# Altium project SpeakEasy_Logic.PrjPcb
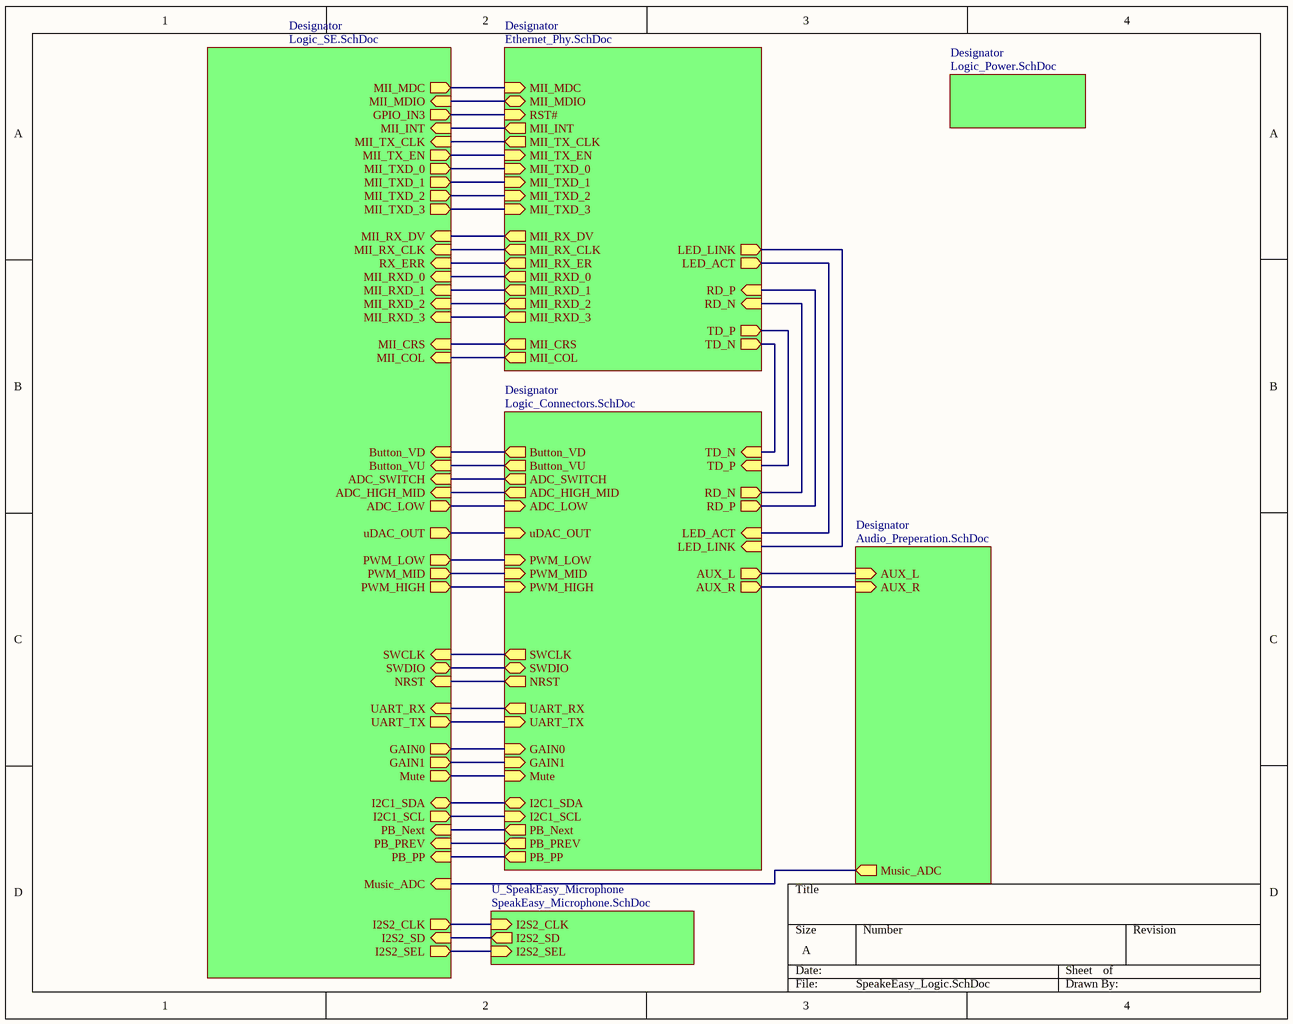
[diagram p0: SpeakeEasy_Logic.SchDoc]
7 sheets, 87 parts. Net scope: hierarchical (ports join the sheet entries above them; power ports are global).
Board file: SpeakEasy_Logic.PcbDoc
Sheets:
  SpeakeEasy_Logic.SchDoc
    Designator = Logic_SE.SchDoc
    Designator = Ethernet_Phy.SchDoc
    Designator = Logic_Connectors.SchDoc
    Designator = Logic_Power.SchDoc
    Designator = Audio_Preperation.SchDoc
    U_SpeakEasy_Microphone = SpeakEasy_Microphone.SchDoc

## Sheet SpeakeEasy_Logic.SchDoc
size A

### Sub-sheets
Designator = Logic_SE.SchDoc: MII_MDC (out), UART_RX (in), MII_TXD_2 (out), MII_CRS (in), I2C1_SCL (out), UART_TX (out), MII_TXD_0 (out), MII_MDIO (in), MII_COL (in), MII_TX_EN (out), MII_RX_DV (in), I2C1_SDA (bidir), MII_TXD_1 (out), MII_RX_CLK (in), MII_TXD_3 (out), MII_TX_CLK (in), GPIO_IN3 (out), PWM_LOW (out), PWM_HIGH (out), PWM_MID (out), Button_VD (in), Button_VU (in), uDAC_OUT (out), MII_RXD_0 (in), MII_RXD_3 (in), MII_RXD_2 (in), MII_RXD_1 (in), Music_ADC (in), SWDIO (bidir), SWCLK (in), NRST (in), GAIN1 (out), Mute (out), GAIN0 (out), ADC_HIGH_MID (in), ADC_SWITCH (in), ADC_LOW (out), PB_Next (in), PB_PP (in), PB_PREV (in), RX_ERR (in), I2S2_CLK (out), I2S2_SD (in), MII_INT (in), I2S2_SEL (out)
Designator = Ethernet_Phy.SchDoc: MII_MDC (in), MII_TXD_3 (in), MII_MDIO (bidir), MII_TXD_0 (in), RST# (in), MII_TX_CLK (out), MII_CRS (out), MII_RX_DV (out), MII_RX_CLK (out), MII_TX_EN (in), MII_TXD_1 (in), MII_TXD_2 (in), MII_RX_ER (out), MII_COL (out), LED_ACT (out), LED_LINK (out), TD_N (out), TD_P (out), RD_P (in), RD_N (in), MII_RXD_3 (out), MII_RXD_1 (out), MII_RXD_0 (out), MII_RXD_2 (out), MII_INT (out)
Designator = Logic_Connectors.SchDoc: Button_VD (out), TD_N (in), TD_P (in), LED_ACT (in), RD_N (out), RD_P (out), AUX_L (out), LED_LINK (in), AUX_R (out), Button_VU (out), PWM_LOW (in), PWM_HIGH (in), uDAC_OUT (in), PWM_MID (in), NRST (out), SWDIO (bidir), UART_TX (in), SWCLK (out), UART_RX (out), GAIN0 (in), GAIN1 (in), Mute (in), ADC_SWITCH (out), ADC_HIGH_MID (out), ADC_LOW (in), I2C1_SCL (in), I2C1_SDA (bidir), PB_PP (out), PB_Next (out), PB_PREV (out)
Designator = Logic_Power.SchDoc: no entries
Designator = Audio_Preperation.SchDoc: Music_ADC (out), AUX_L (in), AUX_R (in)
U_SpeakEasy_Microphone = SpeakEasy_Microphone.SchDoc: I2S2_SD (out), I2S2_CLK (in), I2S2_SEL (in)

### Nets
ADC_HIGH_MID: sheet Designator/ADC_HIGH_MID, sheet Designator/ADC_HIGH_MID
ADC_LOW: sheet Designator/ADC_LOW, sheet Designator/ADC_LOW
AUX_L: sheet Designator/AUX_L, sheet Designator/AUX_L
AUX_R: sheet Designator/AUX_R, sheet Designator/AUX_R
Button_VD: sheet Designator/Button_VD, sheet Designator/Button_VD
Button_VU: sheet Designator/Button_VU, sheet Designator/Button_VU
GAIN0: sheet Designator/GAIN0, sheet Designator/GAIN0
GAIN1: sheet Designator/GAIN1, sheet Designator/GAIN1
GPIO_IN3: sheet Designator/GPIO_IN3, sheet Designator/RST#
I2C1_SCL: sheet Designator/I2C1_SCL, sheet Designator/I2C1_SCL
I2C1_SDA: sheet Designator/I2C1_SDA, sheet Designator/I2C1_SDA
I2S2_CLK: sheet Designator/I2S2_CLK, sheet U_SpeakEasy_Microphone/I2S2_CLK
I2S2_SD: sheet Designator/I2S2_SD, sheet U_SpeakEasy_Microphone/I2S2_SD
I2S2_SEL: sheet Designator/I2S2_SEL, sheet U_SpeakEasy_Microphone/I2S2_SEL
LED_ACT: sheet Designator/LED_ACT, sheet Designator/LED_ACT
LED_LINK: sheet Designator/LED_LINK, sheet Designator/LED_LINK
MII_COL: sheet Designator/MII_COL, sheet Designator/MII_COL
MII_CRS: sheet Designator/MII_CRS, sheet Designator/MII_CRS
MII_INT: sheet Designator/MII_INT, sheet Designator/MII_INT
MII_MDC: sheet Designator/MII_MDC, sheet Designator/MII_MDC
MII_MDIO: sheet Designator/MII_MDIO, sheet Designator/MII_MDIO
MII_RX_CLK: sheet Designator/MII_RX_CLK, sheet Designator/MII_RX_CLK
MII_RX_DV: sheet Designator/MII_RX_DV, sheet Designator/MII_RX_DV
MII_RX_ER: sheet Designator/RX_ERR, sheet Designator/MII_RX_ER
MII_RXD_0: sheet Designator/MII_RXD_0, sheet Designator/MII_RXD_0
MII_RXD_1: sheet Designator/MII_RXD_1, sheet Designator/MII_RXD_1
MII_RXD_2: sheet Designator/MII_RXD_2, sheet Designator/MII_RXD_2
MII_RXD_3: sheet Designator/MII_RXD_3, sheet Designator/MII_RXD_3
MII_TX_CLK: sheet Designator/MII_TX_CLK, sheet Designator/MII_TX_CLK
MII_TX_EN: sheet Designator/MII_TX_EN, sheet Designator/MII_TX_EN
MII_TXD_0: sheet Designator/MII_TXD_0, sheet Designator/MII_TXD_0
MII_TXD_1: sheet Designator/MII_TXD_1, sheet Designator/MII_TXD_1
MII_TXD_2: sheet Designator/MII_TXD_2, sheet Designator/MII_TXD_2
MII_TXD_3: sheet Designator/MII_TXD_3, sheet Designator/MII_TXD_3
Music_ADC: sheet Designator/Music_ADC, sheet Designator/Music_ADC
Mute: sheet Designator/Mute, sheet Designator/Mute
NRST: sheet Designator/NRST, sheet Designator/NRST
PB_Next: sheet Designator/PB_Next, sheet Designator/PB_Next
PB_PP: sheet Designator/PB_PP, sheet Designator/PB_PP
PB_PREV: sheet Designator/PB_PREV, sheet Designator/PB_PREV
PWM_HIGH: sheet Designator/PWM_HIGH, sheet Designator/PWM_HIGH
PWM_LOW: sheet Designator/PWM_LOW, sheet Designator/PWM_LOW
PWM_MID: sheet Designator/PWM_MID, sheet Designator/PWM_MID
RD_N: sheet Designator/RD_N, sheet Designator/RD_N
RD_P: sheet Designator/RD_P, sheet Designator/RD_P
SWCLK: sheet Designator/SWCLK, sheet Designator/SWCLK
SWDIO: sheet Designator/SWDIO, sheet Designator/SWDIO
TD_N: sheet Designator/TD_N, sheet Designator/TD_N
TD_P: sheet Designator/TD_P, sheet Designator/TD_P
UART_RX: sheet Designator/UART_RX, sheet Designator/UART_RX
UART_TX: sheet Designator/UART_TX, sheet Designator/UART_TX
uDAC_OUT: sheet Designator/uDAC_OUT, sheet Designator/uDAC_OUT
NetJ4_1: sheet Designator/ADC_SWITCH, sheet Designator/ADC_SWITCH

## Sheet Logic_SE.SchDoc
size A
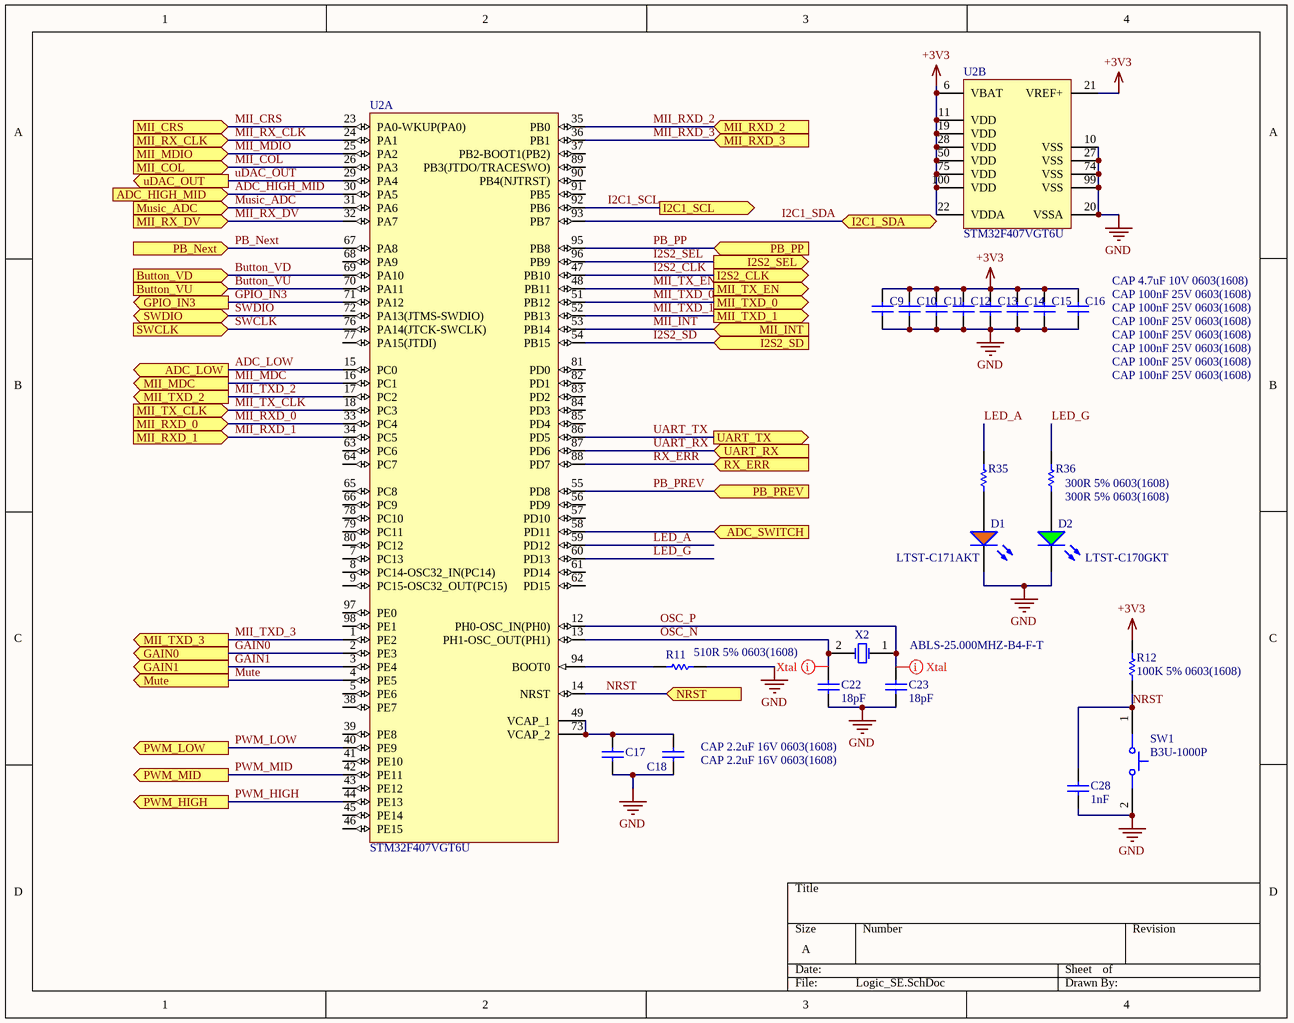
[diagram p1: Logic_SE.SchDoc]

### Parts
(Parts that share a designator on the sheet are numbered #1, #2 ... from top to bottom, then left to right.)
C9  CAP 100nF 25V 0603(1608)  [CAPC0603(1608)100_N]
C10  CAP 100nF 25V 0603(1608)  [CAPC0603(1608)100_N]
C11  CAP 100nF 25V 0603(1608)  [CAPC0603(1608)100_N]
C12  CAP 100nF 25V 0603(1608)  [CAPC0603(1608)100_N]
C13  CAP 100nF 25V 0603(1608)  [CAPC0603(1608)100_N]
C14  CAP 100nF 25V 0603(1608)  [CAPC0603(1608)100_N]
C15#1  CAP 100nF 25V 0603(1608)  [CAPC0603(1608)100_N]
C16  CAP 4.7uF 10V 0603(1608)  [CAPC0603(1608)100_M]
C17  CAP 2.2uF 16V 0603(1608)  [CAPC0603(1608)55_L]
C18  CAP 2.2uF 16V 0603(1608)  [CAPC0603(1608)55_L]
C22  18pF  [CAPC0603(1608)100_L]
C23  18pF  [CAPC0603(1608)100_L]
C28  1nF  [CAPC0603(1608)100_L]
D1  LTST-C171AKT  [LTST-C171AKT_V]
D2  LTST-C170GKT  [LTST-C170GKT_V]
R11  510R 5% 0603(1608)  [RESC0603(1608)_L]
R12  100K 5% 0603(1608)  [RESC0603(1608)_N]
R35  300R 5% 0603(1608)  [RESC0603(1608)_N]
R36  300R 5% 0603(1608)  [RESC0603(1608)_N]
SW1  B3U-1000P  [OMRON-B3U-1000_V]
U2  STM32F407VGT6U  [STM-LQFP100_V]  (parts A,B of 2)
X2  ABLS-25.000MHZ-B4-F-T  [ABRA-ABLS2-2_V]

### Ports
ADC_HIGH_MID (in), ADC_LOW (out), ADC_SWITCH (in), Button_VD (in), Button_VU (in), GAIN0 (out), GAIN1 (out), GPIO_IN3 (out), I2C1_SCL (out), I2C1_SDA (bidir), I2S2_CLK (out), I2S2_SD (in), I2S2_SEL (out), MII_COL (in), MII_CRS (in), MII_INT (in), MII_MDC (out), MII_MDIO (in), MII_RX_CLK (in), MII_RX_DV (in), MII_RXD_0 (in), MII_RXD_1 (in), MII_RXD_2 (in), MII_RXD_3 (in), MII_TX_CLK (in), MII_TX_EN (out), MII_TXD_0 (out), MII_TXD_1 (out), MII_TXD_2 (out), MII_TXD_3 (out), Music_ADC (in), Mute (out), NRST (in), PB_Next (in), PB_PP (in), PB_PREV (in), PWM_HIGH (out), PWM_LOW (out), PWM_MID (out), RX_ERR (in), SWCLK (in), SWDIO (bidir), UART_RX (in), UART_TX (out), uDAC_OUT (out)

### Nets
+3V3: C9.2 C10.2 C11.2 C12.2 C13.2 C14.2 C15#1.2 C16.2 R12.2 U2.6(VBAT) U2.11(VDD) U2.19(VDD) U2.21(VREF+) U2.22(VDDA) U2.28(VDD) U2.50(VDD) U2.75(VDD) U2.100(VDD)
GND: C9.1 C10.1 C11.1 C12.1 C13.1 C14.1 C15#1.1 C16.1 C17.1 C18.1 C22.1 C23.1 C28.1 D1.C D2.C R11.2 SW1.2 U2.10(VSS) U2.20(VSSA) U2.27(VSS) U2.74(VSS) U2.99(VSS)
ADC_HIGH_MID: U2.30(PA5) ; port ADC_HIGH_MID
ADC_LOW: U2.15(PC0) ; port ADC_LOW
Button_VD: U2.69(PA10) ; port Button_VD
Button_VU: U2.70(PA11) ; port Button_VU
GAIN0: U2.2(PE3) ; port GAIN0
GAIN1: U2.3(PE4) ; port GAIN1
GPIO_IN3: U2.71(PA12) ; port GPIO_IN3
I2C1_SCL: U2.92(PB6) ; port I2C1_SCL
I2C1_SDA: U2.93(PB7) ; port I2C1_SDA
I2S2_CLK: U2.47(PB10) ; port I2S2_CLK
I2S2_SD: U2.54(PB15) ; port I2S2_SD
I2S2_SEL: U2.96(PB9) ; port I2S2_SEL
LED_A: R35.2 U2.59(PD12)
LED_G: R36.2 U2.60(PD13)
MII_COL: U2.26(PA3) ; port MII_COL
MII_CRS: U2.23(PA0-WKUP(PA0)) ; port MII_CRS
MII_INT: U2.53(PB14) ; port MII_INT
MII_MDC: U2.16(PC1) ; port MII_MDC
MII_MDIO: U2.25(PA2) ; port MII_MDIO
MII_RX_CLK: U2.24(PA1) ; port MII_RX_CLK
MII_RX_DV: U2.32(PA7) ; port MII_RX_DV
MII_RXD_0: U2.33(PC4) ; port MII_RXD_0
MII_RXD_1: U2.34(PC5) ; port MII_RXD_1
MII_RXD_2: U2.35(PB0) ; port MII_RXD_2
MII_RXD_3: U2.36(PB1) ; port MII_RXD_3
MII_TX_CLK: U2.18(PC3) ; port MII_TX_CLK
MII_TX_EN: U2.48(PB11) ; port MII_TX_EN
MII_TXD_0: U2.51(PB12) ; port MII_TXD_0
MII_TXD_1: U2.52(PB13) ; port MII_TXD_1
MII_TXD_2: U2.17(PC2) ; port MII_TXD_2
MII_TXD_3: U2.1(PE2) ; port MII_TXD_3
Music_ADC: U2.31(PA6) ; port Music_ADC
Mute: U2.4(PE5) ; port Mute
NRST: C28.2 R12.1 SW1.1 U2.14(NRST) ; port NRST
OSC_N: C22.2 U2.13(PH1-OSC_OUT(PH1)) X2.2(X2)
OSC_P: C23.2 U2.12(PH0-OSC_IN(PH0)) X2.1(X1)
PB_Next: U2.67(PA8) ; port PB_Next
PB_PP: U2.95(PB8) ; port PB_PP
PB_PREV: U2.55(PD8) ; port PB_PREV
PWM_HIGH: U2.44(PE13) ; port PWM_HIGH
PWM_LOW: U2.40(PE9) ; port PWM_LOW
PWM_MID: U2.42(PE11) ; port PWM_MID
RX_ERR: U2.88(PD7) ; port RX_ERR  [project net MII_RX_ER]
SWCLK: U2.76(PA14(JTCK-SWCLK)) ; port SWCLK
SWDIO: U2.72(PA13(JTMS-SWDIO)) ; port SWDIO
UART_RX: U2.87(PD6) ; port UART_RX
UART_TX: U2.86(PD5) ; port UART_TX
uDAC_OUT: U2.29(PA4) ; port uDAC_OUT
NetC17_2: C17.2 C18.2 U2.49(VCAP_1) U2.73(VCAP_2)
NetD1_A: D1.A R35.1
NetD2_A: D2.A R36.1
NetJ4_1: U2.58(PD11) ; port ADC_SWITCH
NetR11_1: R11.1 U2.94(BOOT0)

Not connected (* = marked no-connect by the designer): U2 5(PE6) 7(PC13) 8(PC14-OSC32_IN(PC14)) 9(PC15-OSC32_OUT(PC15)) 37(PB2-BOOT1(PB2)) 38(PE7) 39(PE8) 41(PE10) 43(PE12) 45(PE14) 46(PE15) 56(PD9) 57(PD10) 61(PD14) 62(PD15) 63(PC6) 64(PC7) 65(PC8) 66(PC9) 68(PA9) 77(PA15(JTDI)) 78(PC10) 79(PC11) 80(PC12) 81(PD0) 82(PD1) 83(PD2) 84(PD3) 85(PD4) 89(PB3(JTDO/TRACESWO)) 90(PB4(NJTRST)) 91(PB5) 97(PE0) 98(PE1)

### Layout directives
net class Xtal: OSC_N, OSC_P

### Library data of the parts
C9-C14 C15#1 = CMP-1035-02589-1: CAP 100nF 25V ±20% 0603 (1608 Metric) Thickness 1mm SMD; Case-EIA: 0603; Tolerance: Â±20%; Case-Metric: 1608; Value: 100nF; Max Thickness: 1 mm; Technology: SMT; Rated Voltage: 25 V
C16 = CMP-1035-02787-1: CAP 4.7uF 10V ±20% 0603 (1608 Metric) Thickness 1mm SMD; Case-EIA: 0603; Case-Metric: 1608; Tolerance: Â±20%; Value: 4.7uF; Max Thickness: 1 mm; Technology: SMT; Rated Voltage: 10 V
C17 C18 = CMP-1035-02764-1: CAP 2.2uF 16V ±20% 0603 (1608 Metric) Thickness 0.55mm SMD; Tolerance: Â±20%; Case-Metric: 1608; Case-EIA: 0603; Value: 2.2uF; Rated Voltage: 16 V; Max Thickness: 0.55 mm; Technology: SMT
C22 C23 C28 = CMP-1590-00005-1: 0603 (1608 Metric) Chip Capacitor; Case-Metric: 1608; Case-EIA: 0603; PackageReference: CAPC0603(1608)100
D1 = CMP-1674-00004-3: LED AMBER CLR THIN 0805 SMD; Manufacturer: Lite-On; PartNumber: LTST-C171AKT; ComponentLink1URL: http://optoelectronics.liteon.com/upload/download/DS-22-99-0170/S_110_LTST-C171AKT.pdf; PackageReference: C171AKT; ComponentLink1Description: Datasheet
D2 = CMP-1674-00002-2: LED GREEN CLEAR 0805 SMD; ComponentLink1Description: Datasheet; PackageReference: C170GKT; ComponentLink1URL: http://media.digikey.com/pdf/Data%20Sheets/Lite-On%20PDFs/LTST-C170GKT.pdf; PartNumber: LTST-C170GKT
R11 = CMP-1012-00067-1: 510R 0.1W 5% 0603 (1608 Metric)  SMD; Case-EIA: 0603; Value: 510.00 Ohm; Case-Metric: 1608; Technology: SMT; Power: 0.1 W; Tolerance: 5 %
R12 R35 R36 = CMP-1012-00122-1: 100K 0.1W 5% 0603 (1608 Metric)  SMD; Case-EIA: 0603; Value: 100000.00 Ohm; Case-Metric: 1608; Tolerance: 5 %; Power: 0.1 W; Technology: SMT
SW1 = CMP-2100-03586-1: Ultra-Small Tactile Switch, 0.05 A, 12 V, -25 to 70 degC, 2-Pin SMD, RoHS, Tape and Reel; Manufacturer: Omron Electronic Components; Operating Force: 1.5N; Current Rating: 50mA; Voltage Rating (DC): 12V; Electrical Life: 200000Cycles; Actuator Length: 0.4mm; Insulation Resistance: 100MOhm; Switch Travel: 0.15mm; Throw Configuration: SPST; Illumination Type: Illuminated; Width: 3mm; Weight: 0.022g; Datasheet Version: 42005.0; Datasheet URL: http://www.omron.com/ecb/products/pdf/en-b3u.pdf; Height: 1.2mm; Package Quantity: 1; REACH SVHC: Unknown; Contact Current Rating: 50mA; Contact Material: Silver; Max Current Rating: 50mA; Package Reference: B3U-1000; Termination: SMD/SMT; Packaging: TapeandReel; Manufacturer URL: http://www.omron.com/; RoHSCompliant: true; Mount: SurfaceMount; Length: 4mm; Min Operating Temperature: -25degC; Depth: 2.5mm; Lead Free: LeadFree; Case/Package: SMD/SMT; Package Description: 2-Pin Surface Mount Device, Body 3 x 2.5 mm; Max Operating Temperature: 70degC; Orientation: Straight
U2 = CMP-0243-00032-2: ARM Cortex-M4 32-bit MCU+FPU, 210 DMIPS, 1024 kB Flash, 192 kB Internal RAM, 82 I/Os, 100-pin LQFP, -40 to 85 degC, Tray; Manufacturer: STMicroelectronics; D/A Converter: 2x12-bit; Supply Voltage(Vcc) min (V): 1.8; Internal RAM Size (kB): 192; I/Os (High Current): 82; FLASH Size (Prog) (kB): 1024; Supply Voltage(Vcc) max (V): 3.6; Operating Frequency(F) (Processor speed) (MHz): 168; ComponentLink3Description: Package Specification; Mounting Technology: Surface Mount; Core: ARM Cortex-M4; PartNumber: STM32F407VGT6U; PackageDescription: 100-Pin Low Profile Quad Flat Package, 14 x 14 mm Body, 0.5 mm Pitch; PackageReference: LQFP100; ComponentLink1URL: http://www.st.com/web/en/home.html; ComponentLink2Description: Datasheet; Packing: Tray; ComponentLink2URL: http://www.st.com/st-web-ui/static/active/en/resource/technical/document/datasheet/DM00037051.pdf; PackageVersion: Rev. 1, 06/2013; ComponentLink3URL: http://www.st.com/st-web-ui/static/active/en/resource/technical/document/data_brief/DM00071938.pdf; DatasheetVersion: Rev. 4; ComponentLink1Description: Manufacturer URL; PartId: 1
X2 = CMP-0277-00002-1: Low Profile Surface Mount Microprocessor Crystal, 25 MHz +/-30 ppm, 180 Ohm, -40 to 85 degC, 2-Pin 11.4 x 4.7 x 3.3 mm SMD, RoHS, Tape and Reel; Manufacturer: Abracon; PartNumber: ABLS2-4.096MHZ-D4Y-T; Operation Mode: Fundamental or 3rd Overtone; Shunt Capacitance: 7 pF Max.; ESR: 180 Ohm; Load Capacitance: 18 pF; Frequency: 4.096 MHz; Mounting Technology: Surface Mount; PackageDescription: 2-Pin SMD, Body 11.4 x 4.7 mm, Height 3.3 mm; ComponentLink1URL: http://www.abracon.com/; Freq. Stability: +/- 30 ppm; ComponentLink2Description: Datasheet; Operating Temp. Range: -40 to 85 degC; Packing: Tape and Reel; RoHS: TRUE; PackageReference: ABLS2-2; DatasheetVersion: Rev. 03.31.11; Freq. Tolerance: +/- 30 ppm; ComponentLink2URL: http://www.abracon.com/Resonators/ABLS2.pdf; ComponentLink1Description: Manufacturer URL

## Sheet Ethernet_Phy.SchDoc
size A
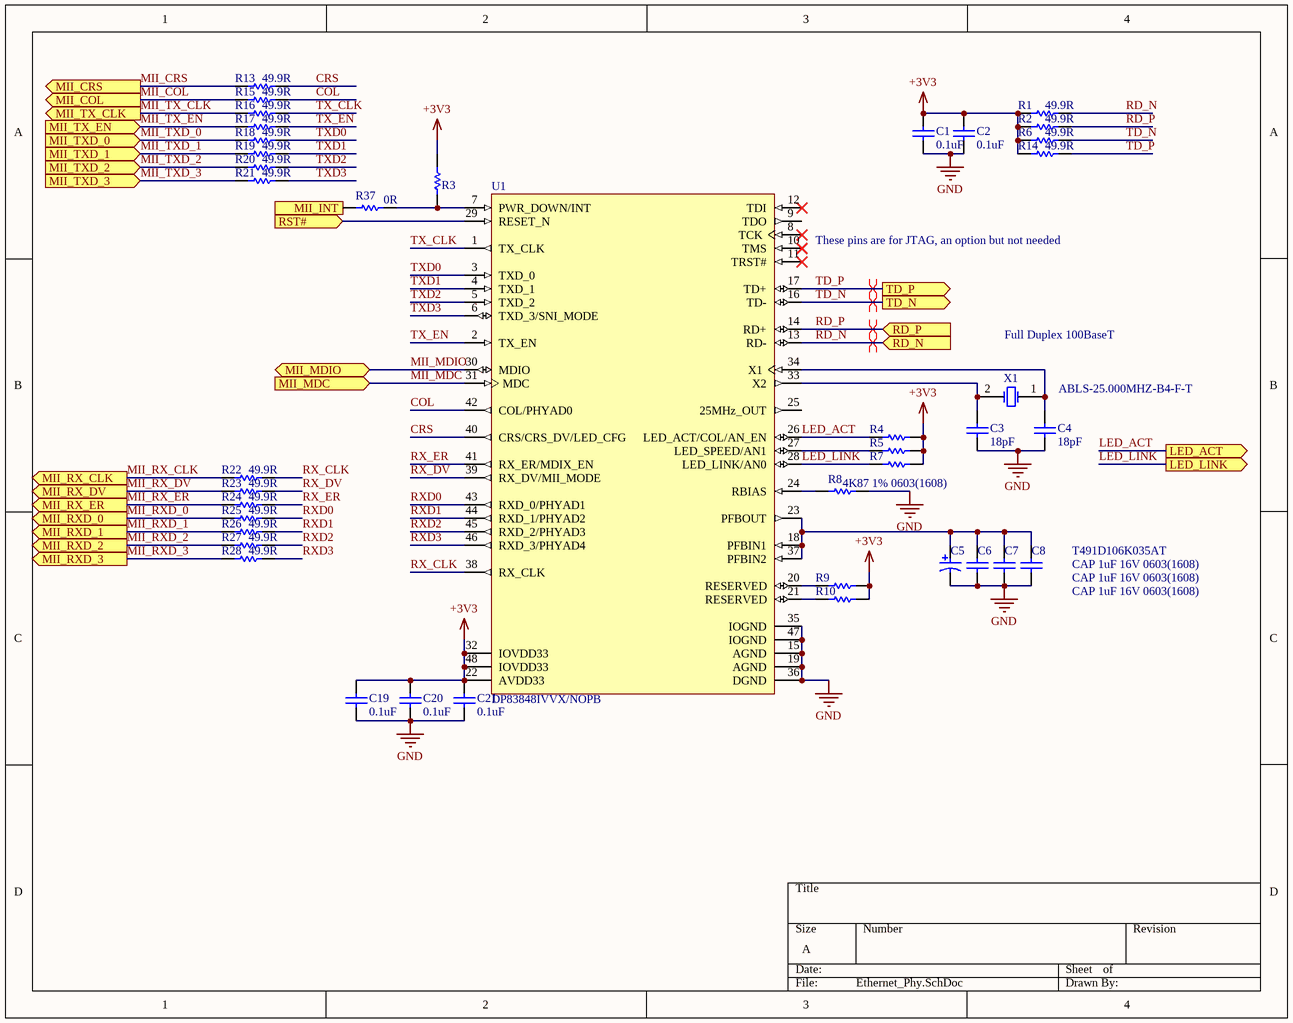
[diagram p2: Ethernet_Phy.SchDoc]

### Parts
C1  0.1uF  [CAPC0603(1608)100_L]
C2  0.1uF  [CAPC0603(1608)100_L]
C3  18pF  [CAPC0603(1608)100_L]
C4  18pF  [CAPC0603(1608)100_L]
C5  T491D106K035AT  [KEMT-T491-D_L]
C6  CAP 1uF 16V 0603(1608)  [CAPC0603(1608)100_N]
C7  CAP 1uF 16V 0603(1608)  [CAPC0603(1608)100_N]
C8  CAP 1uF 16V 0603(1608)  [CAPC0603(1608)100_N]
C19  0.1uF  [CAPC0603(1608)100_L]
C20  0.1uF  [CAPC0603(1608)100_L]
C21  0.1uF  [CAPC0603(1608)100_L]
R1  49.9R  [RESC0603(1608)_L]
R2  49.9R  [RESC0603(1608)_L]
R3  RC0603JR-072K2L  [RESC1608X55X25LL10T15]  (value not drawn)
R4  RC0603JR-072K2L  [RESC1608X55X25LL10T15]  (value not drawn)
R5  RC0603JR-072K2L  [RESC1608X55X25LL10T15]  (value not drawn)
R6  49.9R  [RESC0603(1608)_L]
R7  RC0603JR-072K2L  [RESC1608X55X25LL10T15]  (value not drawn)
R8  4K87 1% 0603(1608)  [RESC0603(1608)_N]
R9  RC0603JR-072K2L  [RESC1608X55X25LL10T15]  (value not drawn)
R10  RC0603JR-072K2L  [RESC1608X55X25LL10T15]  (value not drawn)
R13  49.9R  [RESC0603(1608)_L]
R14  49.9R  [RESC0603(1608)_L]
R15  49.9R  [RESC0603(1608)_L]
R16  49.9R  [RESC0603(1608)_L]
R17  49.9R  [RESC0603(1608)_L]
R18  49.9R  [RESC0603(1608)_L]
R19  49.9R  [RESC0603(1608)_L]
R20  49.9R  [RESC0603(1608)_L]
R21  49.9R  [RESC0603(1608)_L]
R22  49.9R  [RESC0603(1608)_L]
R23  49.9R  [RESC0603(1608)_L]
R24  49.9R  [RESC0603(1608)_L]
R25  49.9R  [RESC0603(1608)_L]
R26  49.9R  [RESC0603(1608)_L]
R27  49.9R  [RESC0603(1608)_L]
R28  49.9R  [RESC0603(1608)_L]
R37  value 0R  [RESC0805(2012)_L]  (hidden comment: RES0805)
U1  DP83848IVVX/NOPB  [PT0048A_L]
X1  ABLS-25.000MHZ-B4-F-T  [ABRA-ABLS2-2_V]

### Ports
LED_ACT (out), LED_LINK (out), MII_COL (out), MII_CRS (out), MII_INT (out), MII_MDC (in), MII_MDIO (bidir), MII_RX_CLK (out), MII_RX_DV (out), MII_RX_ER (out), MII_RXD_0 (out), MII_RXD_1 (out), MII_RXD_2 (out), MII_RXD_3 (out), MII_TX_CLK (out), MII_TX_EN (in), MII_TXD_0 (in), MII_TXD_1 (in), MII_TXD_2 (in), MII_TXD_3 (in), RD_N (in), RD_P (in), RST# (in), TD_N (out), TD_P (out)

### Nets
+3V3: C1.2 C2.2 C19.2 C20.2 C21.2 R1.1 R2.1 R3.2 R4.2 R5.2 R6.1 R7.2 R9.2 R10.2 R14.1 U1.22(AVDD33) U1.32(IOVDD33) U1.48(IOVDD33)
GND: C1.1 C2.1 C3.1 C4.1 C5.2 C6.1 C7.1 C8.1 C19.1 C20.1 C21.1 R8.2 U1.15(AGND) U1.19(AGND) U1.35(IOGND) U1.36(DGND) U1.47(IOGND)
COL: R15.2 U1.42(COL/PHYAD0)
CRS: R13.2 U1.40(CRS/CRS_DV/LED_CFG)
GPIO_IN3: U1.29(RESET_N) ; port RST#
LED_ACT: R4.1 U1.26(LED_ACT/COL/AN_EN) ; port LED_ACT
LED_LINK: R7.1 U1.28(LED_LINK/AN0) ; port LED_LINK
MII_COL: R15.1 ; port MII_COL
MII_CRS: R13.1 ; port MII_CRS
MII_INT: R37.1 ; port MII_INT
MII_MDC: U1.31(MDC) ; port MII_MDC
MII_MDIO: U1.30(MDIO) ; port MII_MDIO
MII_RX_CLK: R22.1 ; port MII_RX_CLK
MII_RX_DV: R23.1 ; port MII_RX_DV
MII_RX_ER: R24.1 ; port MII_RX_ER
MII_RXD_0: R25.1 ; port MII_RXD_0
MII_RXD_1: R26.1 ; port MII_RXD_1
MII_RXD_2: R27.1 ; port MII_RXD_2
MII_RXD_3: R28.1 ; port MII_RXD_3
MII_TX_CLK: R16.1 ; port MII_TX_CLK
MII_TX_EN: R17.1 ; port MII_TX_EN
MII_TXD_0: R18.1 ; port MII_TXD_0
MII_TXD_1: R19.1 ; port MII_TXD_1
MII_TXD_2: R20.1 ; port MII_TXD_2
MII_TXD_3: R21.1 ; port MII_TXD_3
RD_N: R1.2 U1.13(RD-) ; port RD_N
RD_P: R2.2 U1.14(RD+) ; port RD_P
RX_CLK: R22.2 U1.38(RX_CLK)
RX_DV: R23.2 U1.39(RX_DV/MII_MODE)
RX_ER: R24.2 U1.41(RX_ER/MDIX_EN)
RXD0: R25.2 U1.43(RXD_0/PHYAD1)
RXD1: R26.2 U1.44(RXD_1/PHYAD2)
RXD2: R27.2 U1.45(RXD_2/PHYAD3)
RXD3: R28.2 U1.46(RXD_3/PHYAD4)
TD_N: R6.2 U1.16(TD-) ; port TD_N
TD_P: R14.2 U1.17(TD+) ; port TD_P
TX_CLK: R16.2 U1.1(TX_CLK)
TX_EN: R17.2 U1.2(TX_EN)
TXD0: R18.2 U1.3(TXD_0)
TXD1: R19.2 U1.4(TXD_1)
TXD2: R20.2 U1.5(TXD_2)
TXD3: R21.2 U1.6(TXD_3/SNI_MODE)
NetC3_2: C3.2 U1.33(X2) X1.2(X2)
NetC4_2: C4.2 U1.34(X1) X1.1(X1)
NetC5_1: C5.1 C6.2 C7.2 C8.2 U1.18(PFBIN1) U1.23(PFBOUT) U1.37(PFBIN2)
NetR3_1: R3.1 R37.2 U1.7(PWR_DOWN/INT)
NetR5_1: R5.1 U1.27(LED_SPEED/AN1)
NetR8_1: R8.1 U1.24(RBIAS)
NetR9_1: R9.1 U1.20(RESERVED)
NetR10_1: R10.1 U1.21(RESERVED)

Not connected (* = marked no-connect by the designer): U1 8(TCK)* 9(TDO) 10(TMS)* 11(TRST#)* 12(TDI)* 25(25MHz_OUT)

### Layout directives
differential pair; differential pair class RX Diff: RD_N, RD_P
differential pair; differential pair class TX_DIFF: TD_N, TD_P

### Notes on the sheet
- (near U1) These pins are for JTAG, an option but not needed
- Full Duplex 100BaseT

### Library data of the parts
C1-C4 C19-C21 = CMP-1590-00005-1: as C22 on sheet Logic_SE; PackageReference: CAPC0603(1608)100
C5 = CMP-2000-07580-1: Tantalum Capacitor, 10 uF, +/- 10%, 35 V, -55 to 125 degC, 2-Pin SMD, RoHS, Tape and Reel; Manufacturer: Kemet; Capacitance: 10uF; Leakage Current: 3.5uA; Dissipation Factor: 6%; Case\/Package: 2917; Polarity: Polar; Voltage Rating: 35V; ESR (Equivalent Series Resistance): 1Ohm; Life (Hours): 2000Hour; Tolerance: 20%; Max Operating Temperature: 125degC; Length: 7.3mm; Depth: 4.3mm; Termination: SMD/SMT; Case Code (Metric): 7343; Number of Pins: 2; Package Reference: T491-D; Width: 4.3mm; RoHSCompliant: True; Lead Free: LeadFree; Radiation Hardening: No; Height: 2.8mm; Voltage Rating (DC): 35V; REACH SVHC: NoSVHC; Datasheet URL: http://www.kemet.com/Lists/ProductCatalog/Attachments/254/KEM_T2005_T491.pdf; Datasheet Version: 07/2017; Manufacturer URL: http://www.kemet.com/; Mounting Technology: SurfaceMount; Min Operating Temperature: -55degC; Case Code (Imperial): 2917; Package Quantity: 1; Packaging: TapeandReel; Package Description: 2-Pin Surface Mount Device, Body 7.3 x 4.3 mm; Height - Seated (Max): 0.122inch; Voltage: 35V; Dielectric Material: Tantalum; Mount: PCB
C6-C8 = CMP-1035-02736-1: CAP 1uF 16V ±5% 0603 (1608 Metric) Thickness 1mm SMD; Case-Metric: 1608; Case-EIA: 0603; Tolerance: Â±5%; Technology: SMT; Max Thickness: 1 mm; Rated Voltage: 16 V; Value: 1uF
R1 R2 R6 R13-R28 = CMP-1591-00001-1: 0603 (1608 Metric) Chip Resistor; Case-Metric: 1608; Case-EIA: 0603; Value: 49.9R; PackageReference: RESC0603(1608)
R3-R5 R7 R9 R10 = CMP-2000-06957-1: Chip Resistor, 2.2 KOhm, +/- 5%, 0.1 W, -55 to 155 degC, 0603 (1608 Metric), RoHS, Tape and Reel; Manufacturer: Yageo; Resistance: 2.2kOhms; Temperature Coefficient: 100PPM/C; Voltage Rating: 50V; Power Rating: 100mW; Product: ThickFilmResistorsGeneralPurpose; Manufacturer URL: http://www.yageo.com/; Datasheet URL: http://www.yageo.com/documents/recent/PYu-RC_Group_51_RoHS_L_7.pdf; Package Description: 2-Pin Surface Mount Device, Body 1.6 x 0.8 mm; Mounting Technology: SurfaceMount; Case Code - mm: 1608; Case Code - in: 0603; Packaging: Reel; Operating Temperature Range: -55Cto+155C; Series: RC; Termination Style: SMD/SMT; Package Reference: 0603; Datasheet Version: Rev. 7, 05/2017; Tolerance: 5%
R8 = CMP-1012-00588-1: 4K87 0.1W 1% 0603 (1608 Metric)  SMD; Case-EIA: 0603; Case-Metric: 1608; Value: 4870.00 Ohm; Power: 0.1 W; Technology: SMT; Tolerance: 1 %
R37 = CMP-1591-00002-1: 0805 (2012 Metric) Chip Resistor; Case-EIA: 0805; Case-Metric: 2012; PackageReference: RESC0805(2012)
U1 = CMP-0058-01357-3: PHYTER® Industrial Temperature Single Port 10/100 Mb/s Ethernet Physical Layer Transceiver, 48-pin LQFP, Pb-Free, 1000 Reel; Manufacturer: Texas Instruments; CompType: Interface IC; PackageTopMarking: NSUZXYTT*DP83848VV*VBI; PowerWise: N; High-Reliability: Y; PackageDescription: LQFP, 7 x 7 x 1.4mm, 48 Lead, 0.5mm Pitch; ComponentLink1Description: Datasheet URL; PackageReference: PT0048A; PartNumber: DP83848IVVX/NOPB; ComponentLink1URL: http://www.ti.com/general/docs/lit/getliterature.tsp?genericPartNumber=DP83848I&fileType=pdf; PinCount: 48; RoHS: Y
X1 = CMP-0277-00002-1: as X2 on sheet Logic_SE; Mounting Technology: Surface Mount; PackageDescription: 2-Pin SMD, Body 11.4 x 4.7 mm, Height 3.3 mm; ComponentLink1URL: http://www.abracon.com/; Freq. Stability: +/- 30 ppm; ComponentLink2Description: Datasheet; Operating Temp. Range: -40 to 85 degC; Packing: Tape and Reel; RoHS: TRUE; PackageReference: ABLS2-2; DatasheetVersion: Rev. 03.31.11; Freq. Tolerance: +/- 30 ppm; ComponentLink2URL: http://www.abracon.com/Resonators/ABLS2.pdf; ComponentLink1Description: Manufacturer URL

## Sheet Logic_Connectors.SchDoc
size A
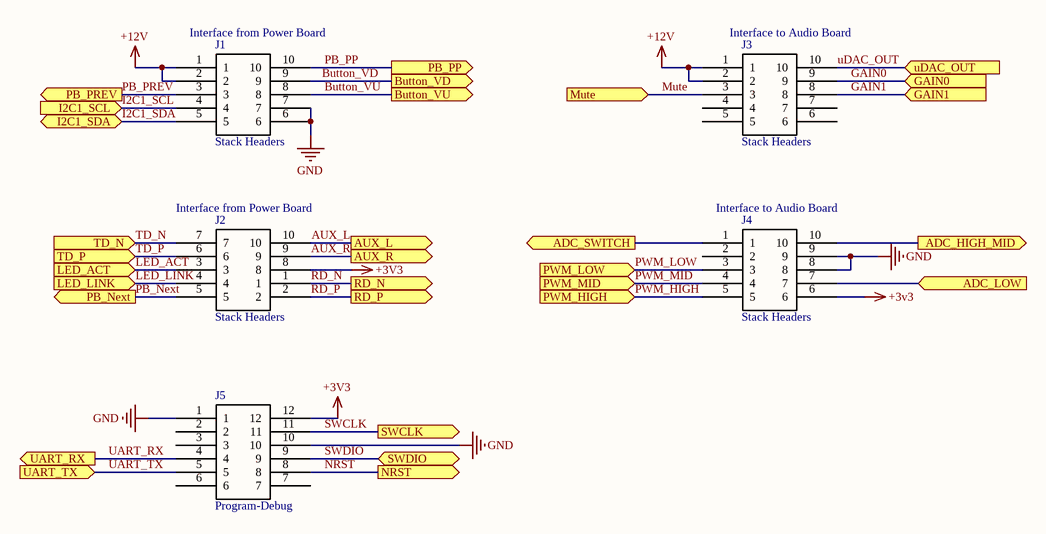
[diagram p3: Logic_Connectors.SchDoc]

### Parts
J1  Stack Headers  [SSW-105]
J2  Stack Headers  [SSW-105]
J3  Stack Headers  [TSW-105]
J4  Stack Headers  [TSW-105]
J5  Program-Debug  [SSW_Double_Header]

### Ports
ADC_HIGH_MID (out), ADC_LOW (in), ADC_SWITCH (out), AUX_L (out), AUX_R (out), Button_VD (out), Button_VU (out), GAIN0 (in), GAIN1 (in), I2C1_SCL (in), I2C1_SDA (bidir), LED_ACT (in), LED_LINK (in), Mute (in), NRST (out), PB_Next (out), PB_PP (out), PB_PREV (out), PWM_HIGH (in), PWM_LOW (in), PWM_MID (in), RD_N (out), RD_P (out), SWCLK (out), SWDIO (bidir), TD_N (in), TD_P (in), UART_RX (out), UART_TX (in), uDAC_OUT (in)

### Nets
+3V3: J2.8 J4.6 J5.12
+12V: J1.1 J1.2 J3.1 J3.2
GND: J1.6 J1.7 J4.8 J4.9 J5.1 J5.10
ADC_HIGH_MID: J4.10 ; port ADC_HIGH_MID
ADC_LOW: J4.7 ; port ADC_LOW
AUX_L: J2.10 ; port AUX_L
AUX_R: J2.9 ; port AUX_R
Button_VD: J1.9 ; port Button_VD
Button_VU: J1.8 ; port Button_VU
GAIN0: J3.9 ; port GAIN0
GAIN1: J3.8 ; port GAIN1
I2C1_SCL: J1.4 ; port I2C1_SCL
I2C1_SDA: J1.5 ; port I2C1_SDA
LED_ACT: J2.3 ; port LED_ACT
LED_LINK: J2.4 ; port LED_LINK
Mute: J3.3 ; port Mute
NRST: J5.8 ; port NRST
PB_Next: J2.5 ; port PB_Next
PB_PP: J1.10 ; port PB_PP
PB_PREV: J1.3 ; port PB_PREV
PWM_HIGH: J4.5 ; port PWM_HIGH
PWM_LOW: J4.3 ; port PWM_LOW
PWM_MID: J4.4 ; port PWM_MID
RD_N: J2.1 ; port RD_N
RD_P: J2.2 ; port RD_P
SWCLK: J5.11 ; port SWCLK
SWDIO: J5.9 ; port SWDIO
TD_N: J2.7 ; port TD_N
TD_P: J2.6 ; port TD_P
UART_RX: J5.4 ; port UART_RX
UART_TX: J5.5 ; port UART_TX
uDAC_OUT: J3.10 ; port uDAC_OUT
NetJ4_1: J4.1 ; port ADC_SWITCH

Not connected (* = marked no-connect by the designer): J3 4 5 6 7; J4 2; J5 2 3 6 7

### Notes on the sheet
- (near J1) Interface from Power Board
- (near J3) Interface to Audio Board
- (near J2) Interface from Power Board
- (near J4) Interface to Audio Board

### Library data of the parts
J1-J4 = Stack Headers: System: Connector

## Sheet Logic_Power.SchDoc
size A
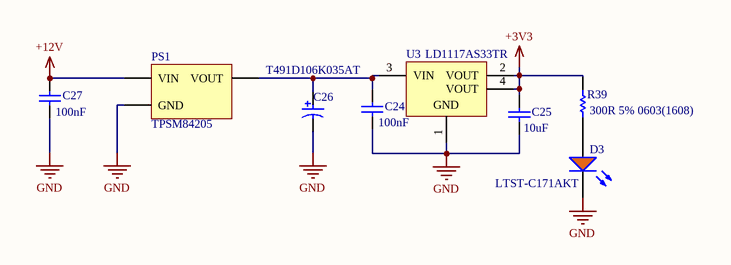
[diagram p4: Logic_Power.SchDoc]

### Parts
C24  100nF  [CAPC0805(2012)145_L]
C25  10uF  [CAPC0805(2012)145_L]
C26  T491D106K035AT  [KEMT-T491-D_L]
C27  100nF  [CAPC0805(2012)145_L]
D3  LTST-C171AKT  [LTST-C171AKT_V]
PS1  TPSM84205  [tpsm84205]
R39  300R 5% 0603(1608)  [RESC0603(1608)_N]
U3  LD1117AS33TR  [SOT-223_M]

### Nets
+3V3: C25.2 R39.2 U3.2(VOUT) U3.4(VOUT)
+12V: C27.2 PS1.1(VIN)
GND: C24.1 C25.1 C26.2 C27.1 D3.C PS1.2(GND) U3.1(GND)
NetC24_2: C24.2 C26.1 PS1.3(VOUT) U3.3(VIN)
NetD3_A: D3.A R39.1

### Library data of the parts
C24 C25 C27 = CMP-1590-00003-1: 0805 (2012 Metric) Chip Capacitor; Case-EIA: 0805; Case-Metric: 2012; PackageReference: CAPC0805(2012)145
  C24 C27: Value: 100nF
  C25: Value: 10uF
C26 = CMP-2000-07580-1: as C5 on sheet Ethernet_Phy; Max Operating Temperature: 125degC; Length: 7.3mm; Depth: 4.3mm; Termination: SMD/SMT; Case Code (Metric): 7343; Number of Pins: 2; Package Reference: T491-D; Width: 4.3mm; RoHSCompliant: True; Lead Free: LeadFree; Radiation Hardening: No; Height: 2.8mm; Voltage Rating (DC): 35V; REACH SVHC: NoSVHC; Datasheet URL: http://www.kemet.com/Lists/ProductCatalog/Attachments/254/KEM_T2005_T491.pdf; Datasheet Version: 07/2017; Manufacturer URL: http://www.kemet.com/; Mounting Technology: SurfaceMount; Min Operating Temperature: -55degC; Case Code (Imperial): 2917; Package Quantity: 1; Packaging: TapeandReel; Package Description: 2-Pin Surface Mount Device, Body 7.3 x 4.3 mm; Height - Seated (Max): 0.122inch; Voltage: 35V; Dielectric Material: Tantalum; Mount: PCB
D3 = CMP-1674-00004-3: as D1 on sheet Logic_SE; PartNumber: LTST-C171AKT; ComponentLink1URL: http://optoelectronics.liteon.com/upload/download/DS-22-99-0170/S_110_LTST-C171AKT.pdf; PackageReference: C171AKT; ComponentLink1Description: Datasheet
R39 = CMP-1012-00122-1: as R12 on sheet Logic_SE; Tolerance: 5 %; Power: 0.1 W; Technology: SMT
U3 = CMP-0244-00316-1: 1A, Low Drop Positive Voltage Regulator, 3.3V, 4-Pin SOT-223, Tape and Reel; ComponentLink1Description: Manufacturer URL; DatasheetVersion: 2/12/2011; PackageVersion: 2010; ComponentLink1URL: http://www.st.com; ComponentLink2Description: Datasheet; ComponentLink2URL: http://www.st.com/internet/com/TECHNICAL_RESOURCES/TECHNICAL_LITERATURE/DATASHEET/CD00002116.pdf; PackageDescription: 4-Pin SOT-223 Package, 6.5 x 3.5 mm Body, 2.3 mm Pitch, 7 mm Lead Span; PackageReference: SOT-223

## Sheet Audio_Preperation.SchDoc
size A
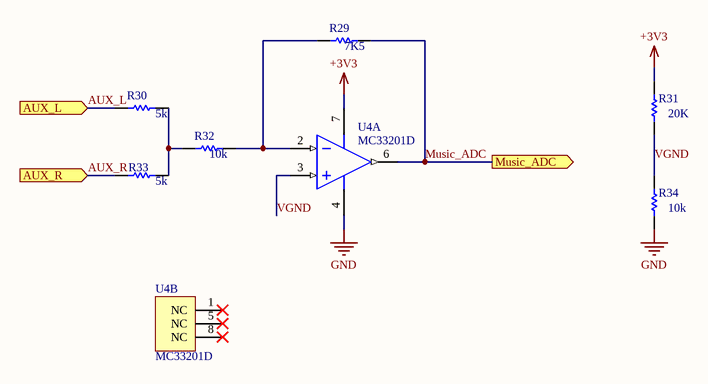
[diagram p5: Audio_Preperation.SchDoc]

### Parts
(Parts that share a designator on the sheet are numbered #1, #2 ... from top to bottom, then left to right.)
R29  7K5  [RESC0805(2012)_L]
R30  5k  [RESC0805(2012)_L]
R31#1  20k  [RESC0805(2012)_L]
R32  10K  [RESC0805(2012)_L]
R33  5k  [RESC0805(2012)_L]
R34  10k  [RESC0805(2012)_L]
U4  MC33201D  [ONSC-SOIC-8-751-07_V]  (parts A,B of 2)

### Ports
AUX_L (in), AUX_R (in), Music_ADC (out)

### Nets
+3V3: R31#1.2 U4.7(VCC)
GND: R34.1 U4.4(VEE)
AUX_L: R30.1 ; port AUX_L
AUX_R: R33.1 ; port AUX_R
Music_ADC: R29.2 U4.6(OUT) ; port Music_ADC
VGND: R31#1.1 R34.2 U4.3(IN+)
NetR29_1: R29.1 R32.2 U4.2(IN-)
NetR30_2: R30.2 R32.1 R33.2

Not connected (* = marked no-connect by the designer): U4 1(NC)* 5(NC)* 8(NC)*

### Library data of the parts
R29 R30 R31#1 R32-R34 = CMP-1591-00002-1: as R37 on sheet Ethernet_Phy; PackageReference: RESC0805(2012)
  R29: Value: 7K5
  R30 R33: Value: 5k
  R31#1: Value: 20K
  R32 R34: Value: 10k
U4 = CMP-1310-00330-1: Low Voltage, Rail-to-Rail Operational Amplifier, 1.8 to 12 V, -40 to 105 degC, 8-Pin SOIC, Tube; Manufacturer: On Semiconductor; VCC Min (V): 1.8; SR Typ (V/uS): 1; VCC Max (V): 12; GBW Typ (MHz): 2.2; ComponentLink1Description: Manufacturer URL; Mounting Technology: Surface Mount; ComponentLink2Description: Datasheet; PackageDescription: 8-Pin Small Outline Integrated Circuit, Body 4.9 x 3.9 mm, Pitch 1.27 mm; PackageReference: SOIC-8-751-07; ComponentLink2URL: http://www.onsemi.cn/pub_link/Collateral/MC33201-D.PDF; PartNumber: MC33201D; DatasheetVersion: Rev. 17; ComponentLink3Description: Package Specification; Packing: Tube; PackageVersion: Rev. AK, 02/2011; ComponentLink3URL: http://www.onsemi.com/pub_link/Collateral/751-07.PDF; ComponentLink1URL: http://www.onsemi.com/; RoHS: FALSE; PartId: 1

## Sheet SpeakEasy_Microphone.SchDoc
size A
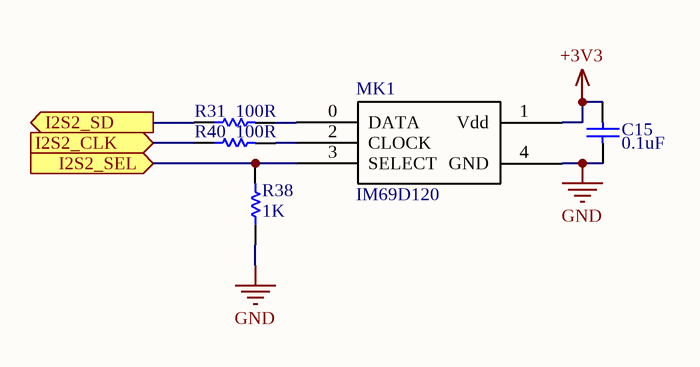
[diagram p6: SpeakEasy_Microphone.SchDoc]

### Parts
(Parts that share a designator on the sheet are numbered #1, #2 ... from top to bottom, then left to right.)
C15#2  0.1uF  [CAPC0805(2012)145_L]
MK1  IM69D120  [M69D120]
R31#2  100R  [RESC0805(2012)_L]
R38  1k  [RESC0805(2012)_L]
R40  100R  [RESC0805(2012)_L]

### Ports
I2S2_CLK (in), I2S2_SD (out), I2S2_SEL (in)

### Nets
+3V3: C15#2.2 MK1.1(Vdd)
GND: C15#2.1 MK1.4(GND) R38.1
I2S2_CLK: R40.1 ; port I2S2_CLK
I2S2_SD: R31#2.1 ; port I2S2_SD
I2S2_SEL: MK1.3(SELECT) R38.2 ; port I2S2_SEL
NetMK1_0: MK1.0(DATA) R31#2.2
NetMK1_2: MK1.2(CLOCK) R40.2

### Library data of the parts
C15#2 = CMP-1590-00003-1: as C24 on sheet Logic_Power; PackageReference: CAPC0805(2012)145; Value: 0.1uF
MK1 = IM69D120: High Performance MEMS microphone utilizing PDM; pin to pad: 0>1 1>2 2>3 3>4 4>5; ComponentLink1Description: Datasheet; ComponentLink1URL: https://www.infineon.com/dgdl/Infineon-IM69D120-DS-v01_00-EN.pdf?fileId=5546d462602a9dc801607a0e41a01a2b
R31#2 R38 R40 = CMP-1591-00002-1: as R37 on sheet Ethernet_Phy; PackageReference: RESC0805(2012)
  R31#2 R40: Value: 100R
  R38: Value: 1K

## Nets that join several sheets
+3V3: Logic_SE (18 pins), Ethernet_Phy (18 pins), Logic_Connectors (J2.8 J4.6 J5.12), Logic_Power (C25.2 R39.2 U3.2 U3.4), Audio_Preperation (R31#1.2 U4.7), SpeakEasy_Microphone (C15#2.2 MK1.1)
+12V: Logic_Connectors (J1.1 J1.2 J3.1 J3.2), Logic_Power (C27.2 PS1.1)
GND: Logic_SE (22 pins), Ethernet_Phy (17 pins), Logic_Connectors (6 pins), Logic_Power (7 pins), Audio_Preperation (R34.1 U4.4), SpeakEasy_Microphone (C15#2.1 MK1.4 R38.1)
ADC_HIGH_MID: Logic_SE (U2.30), Logic_Connectors (J4.10)
ADC_LOW: Logic_SE (U2.15), Logic_Connectors (J4.7)
AUX_L: Logic_Connectors (J2.10), Audio_Preperation (R30.1)
AUX_R: Logic_Connectors (J2.9), Audio_Preperation (R33.1)
Button_VD: Logic_SE (U2.69), Logic_Connectors (J1.9)
Button_VU: Logic_SE (U2.70), Logic_Connectors (J1.8)
GAIN0: Logic_SE (U2.2), Logic_Connectors (J3.9)
GAIN1: Logic_SE (U2.3), Logic_Connectors (J3.8)
GPIO_IN3: Logic_SE (U2.71), Ethernet_Phy (U1.29)
I2C1_SCL: Logic_SE (U2.92), Logic_Connectors (J1.4)
I2C1_SDA: Logic_SE (U2.93), Logic_Connectors (J1.5)
I2S2_CLK: Logic_SE (U2.47), SpeakEasy_Microphone (R40.1)
I2S2_SD: Logic_SE (U2.54), SpeakEasy_Microphone (R31#2.1)
I2S2_SEL: Logic_SE (U2.96), SpeakEasy_Microphone (MK1.3 R38.2)
LED_ACT: Ethernet_Phy (R4.1 U1.26), Logic_Connectors (J2.3)
LED_LINK: Ethernet_Phy (R7.1 U1.28), Logic_Connectors (J2.4)
MII_COL: Logic_SE (U2.26), Ethernet_Phy (R15.1)
MII_CRS: Logic_SE (U2.23), Ethernet_Phy (R13.1)
MII_INT: Logic_SE (U2.53), Ethernet_Phy (R37.1)
MII_MDC: Logic_SE (U2.16), Ethernet_Phy (U1.31)
MII_MDIO: Logic_SE (U2.25), Ethernet_Phy (U1.30)
MII_RX_CLK: Logic_SE (U2.24), Ethernet_Phy (R22.1)
MII_RX_DV: Logic_SE (U2.32), Ethernet_Phy (R23.1)
MII_RX_ER: Logic_SE (U2.88), Ethernet_Phy (R24.1)
MII_RXD_0: Logic_SE (U2.33), Ethernet_Phy (R25.1)
MII_RXD_1: Logic_SE (U2.34), Ethernet_Phy (R26.1)
MII_RXD_2: Logic_SE (U2.35), Ethernet_Phy (R27.1)
MII_RXD_3: Logic_SE (U2.36), Ethernet_Phy (R28.1)
MII_TX_CLK: Logic_SE (U2.18), Ethernet_Phy (R16.1)
MII_TX_EN: Logic_SE (U2.48), Ethernet_Phy (R17.1)
MII_TXD_0: Logic_SE (U2.51), Ethernet_Phy (R18.1)
MII_TXD_1: Logic_SE (U2.52), Ethernet_Phy (R19.1)
MII_TXD_2: Logic_SE (U2.17), Ethernet_Phy (R20.1)
MII_TXD_3: Logic_SE (U2.1), Ethernet_Phy (R21.1)
Music_ADC: Logic_SE (U2.31), Audio_Preperation (R29.2 U4.6)
Mute: Logic_SE (U2.4), Logic_Connectors (J3.3)
NetJ4_1: Logic_SE (U2.58), Logic_Connectors (J4.1)
NRST: Logic_SE (C28.2 R12.1 SW1.1 U2.14), Logic_Connectors (J5.8)
PB_Next: Logic_SE (U2.67), Logic_Connectors (J2.5)
PB_PP: Logic_SE (U2.95), Logic_Connectors (J1.10)
PB_PREV: Logic_SE (U2.55), Logic_Connectors (J1.3)
PWM_HIGH: Logic_SE (U2.44), Logic_Connectors (J4.5)
PWM_LOW: Logic_SE (U2.40), Logic_Connectors (J4.3)
PWM_MID: Logic_SE (U2.42), Logic_Connectors (J4.4)
RD_N: Ethernet_Phy (R1.2 U1.13), Logic_Connectors (J2.1)
RD_P: Ethernet_Phy (R2.2 U1.14), Logic_Connectors (J2.2)
SWCLK: Logic_SE (U2.76), Logic_Connectors (J5.11)
SWDIO: Logic_SE (U2.72), Logic_Connectors (J5.9)
TD_N: Ethernet_Phy (R6.2 U1.16), Logic_Connectors (J2.7)
TD_P: Ethernet_Phy (R14.2 U1.17), Logic_Connectors (J2.6)
UART_RX: Logic_SE (U2.87), Logic_Connectors (J5.4)
UART_TX: Logic_SE (U2.86), Logic_Connectors (J5.5)
uDAC_OUT: Logic_SE (U2.29), Logic_Connectors (J3.10)